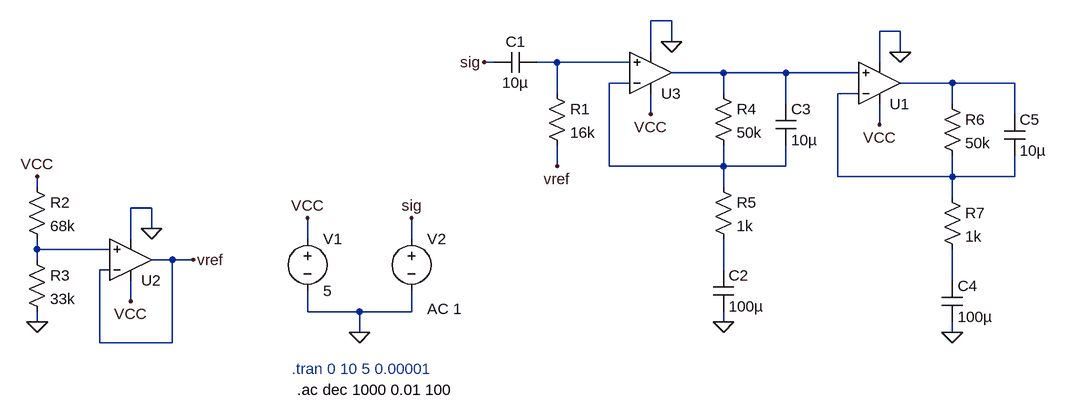
[diagram p0: schematic Draft4.asc]
Draft4.asc, the LTspice schematic file:
Version 4.1
SHEET 1 1160 680
WIRE 576 -224 544 -224
WIRE 928 -208 896 -208
WIRE 576 -192 576 -224
WIRE 544 -176 544 -224
WIRE 928 -176 928 -208
WIRE 304 -160 288 -160
WIRE 400 -160 368 -160
WIRE 512 -160 400 -160
WIRE 896 -160 896 -208
WIRE 656 -144 576 -144
WIRE 752 -144 656 -144
WIRE 864 -144 752 -144
WIRE 512 -128 480 -128
WIRE 1008 -128 928 -128
WIRE 1104 -128 1008 -128
WIRE 400 -112 400 -160
WIRE 656 -112 656 -144
WIRE 864 -112 832 -112
WIRE 752 -96 752 -144
WIRE 1008 -96 1008 -128
WIRE 544 -80 544 -112
WIRE 1104 -80 1104 -128
WIRE 896 -64 896 -96
WIRE 400 0 400 -32
WIRE 480 0 480 -128
WIRE 656 0 656 -32
WIRE 656 0 480 0
WIRE 752 0 752 -32
WIRE 752 0 656 0
WIRE 832 16 832 -112
WIRE 1008 16 1008 -16
WIRE 1008 16 832 16
WIRE 1104 16 1104 -16
WIRE 1104 16 1008 16
WIRE -400 32 -400 16
WIRE 656 32 656 0
WIRE 1008 48 1008 16
WIRE -224 64 -256 64
WIRE -224 96 -224 64
WIRE -256 112 -256 64
WIRE 16 112 16 80
WIRE 176 112 176 80
WIRE -400 128 -400 112
WIRE -288 128 -400 128
WIRE -400 144 -400 128
WIRE -192 144 -224 144
WIRE -160 144 -192 144
WIRE -288 160 -304 160
WIRE 656 160 656 112
WIRE 1008 176 1008 128
WIRE -256 208 -256 176
WIRE 16 224 16 192
WIRE 96 224 16 224
WIRE 176 224 176 192
WIRE 176 224 96 224
WIRE -400 240 -400 224
WIRE 656 240 656 224
WIRE 96 256 96 224
WIRE 1008 256 1008 240
WIRE -304 272 -304 160
WIRE -192 272 -192 144
WIRE -192 272 -304 272
FLAG 96 256 0
FLAG 16 80 VCC
FLAG 176 80 sig
FLAG -400 240 0
FLAG -224 96 0
FLAG -256 208 VCC
FLAG -400 16 VCC
FLAG -160 144 vref
FLAG 400 0 vref
FLAG 576 -192 0
FLAG 544 -80 VCC
FLAG 656 240 0
FLAG 288 -160 sig
FLAG 928 -176 0
FLAG 896 -64 VCC
FLAG 1008 256 0
SYMBOL voltage 16 96 R0
WINDOW 123 0 0 Left 0
WINDOW 39 0 0 Left 0
SYMATTR InstName V1
SYMATTR Value 5
SYMBOL voltage 176 96 R0
WINDOW 123 24 124 Left 2
WINDOW 39 0 0 Left 0
SYMATTR InstName V2
SYMATTR Value ""
SYMATTR Value2 AC 1
SYMBOL res 384 -128 R0
SYMATTR InstName R1
SYMATTR Value 16k
SYMBOL cap 368 -176 R90
WINDOW 0 0 32 VBottom 2
WINDOW 3 32 32 VTop 2
SYMATTR InstName C1
SYMATTR Value 10µ
SYMBOL OpAmps\\UniversalOpAmp2 -256 144 M180
SYMATTR InstName U2
SYMBOL res -416 16 R0
SYMATTR InstName R2
SYMATTR Value 68k
SYMBOL res -416 128 R0
SYMATTR InstName R3
SYMATTR Value 33k
SYMBOL OpAmps\\UniversalOpAmp2 544 -144 M180
SYMATTR InstName U3
SYMBOL res 640 -128 R0
SYMATTR InstName R4
SYMATTR Value 50k
SYMBOL res 640 16 R0
SYMATTR InstName R5
SYMATTR Value 1k
SYMBOL cap 640 160 R0
SYMATTR InstName C2
SYMATTR Value 100µ
SYMBOL cap 736 -96 R0
SYMATTR InstName C3
SYMATTR Value 10µ
SYMBOL OpAmps\\UniversalOpAmp2 896 -128 M180
SYMATTR InstName U1
SYMBOL res 992 -112 R0
SYMATTR InstName R6
SYMATTR Value 50k
SYMBOL res 992 32 R0
SYMATTR InstName R7
SYMATTR Value 1k
SYMBOL cap 992 176 R0
SYMATTR InstName C4
SYMATTR Value 100µ
SYMBOL cap 1088 -80 R0
SYMATTR InstName C5
SYMATTR Value 10µ
TEXT -8 312 Left 2 ;.tran 0 10 5 0.00001
TEXT 0 344 Left 2 !.ac dec 1000 0.01 100

The netlist it stands for:
* Draft4.asc
V1 VCC 0 5
V2 sig 0 AC 1
R1 N001 vref 16k
C1 N001 sig 10µ
X§U2 N006 vref VCC 0 vref level2 Avol=1Meg GBW=10Meg Slew=10Meg Ilimit=25m Rail=0 Vos=0 En=0 Enk=0 In=0 Ink=0 Rin=500Meg  ; pins In+ In- V+ V- OUT
R2 VCC N006 68k
R3 N006 0 33k
X§U3 N001 N003 VCC 0 N002 level2 Avol=1Meg GBW=10Meg Slew=10Meg Ilimit=25m Rail=0 Vos=0 En=0 Enk=0 In=0 Ink=0 Rin=500Meg  ; pins In+ In- V+ V- OUT
R4 N002 N003 50k
R5 N003 N007 1k
C2 N007 0 100µ
C3 N002 N003 10µ
X§U1 N002 N005 VCC 0 N004 level2 Avol=1Meg GBW=10Meg Slew=10Meg Ilimit=25m Rail=0 Vos=0 En=0 Enk=0 In=0 Ink=0 Rin=500Meg  ; pins In+ In- V+ V- OUT
R6 N004 N005 50k
R7 N005 N008 1k
C4 N008 0 100µ
C5 N004 N005 10µ
* .tran 0 10 5 0.00001
.ac dec 1000 0.01 100
.lib UniversalOpAmp2.lib
.backanno
.end